# Altium schematic sheet 01_MCU.SchDoc: MCU
size A4; Project_Name: Monitoring_Control_Circuit; Designer: Hao Thai; Version: 1.0
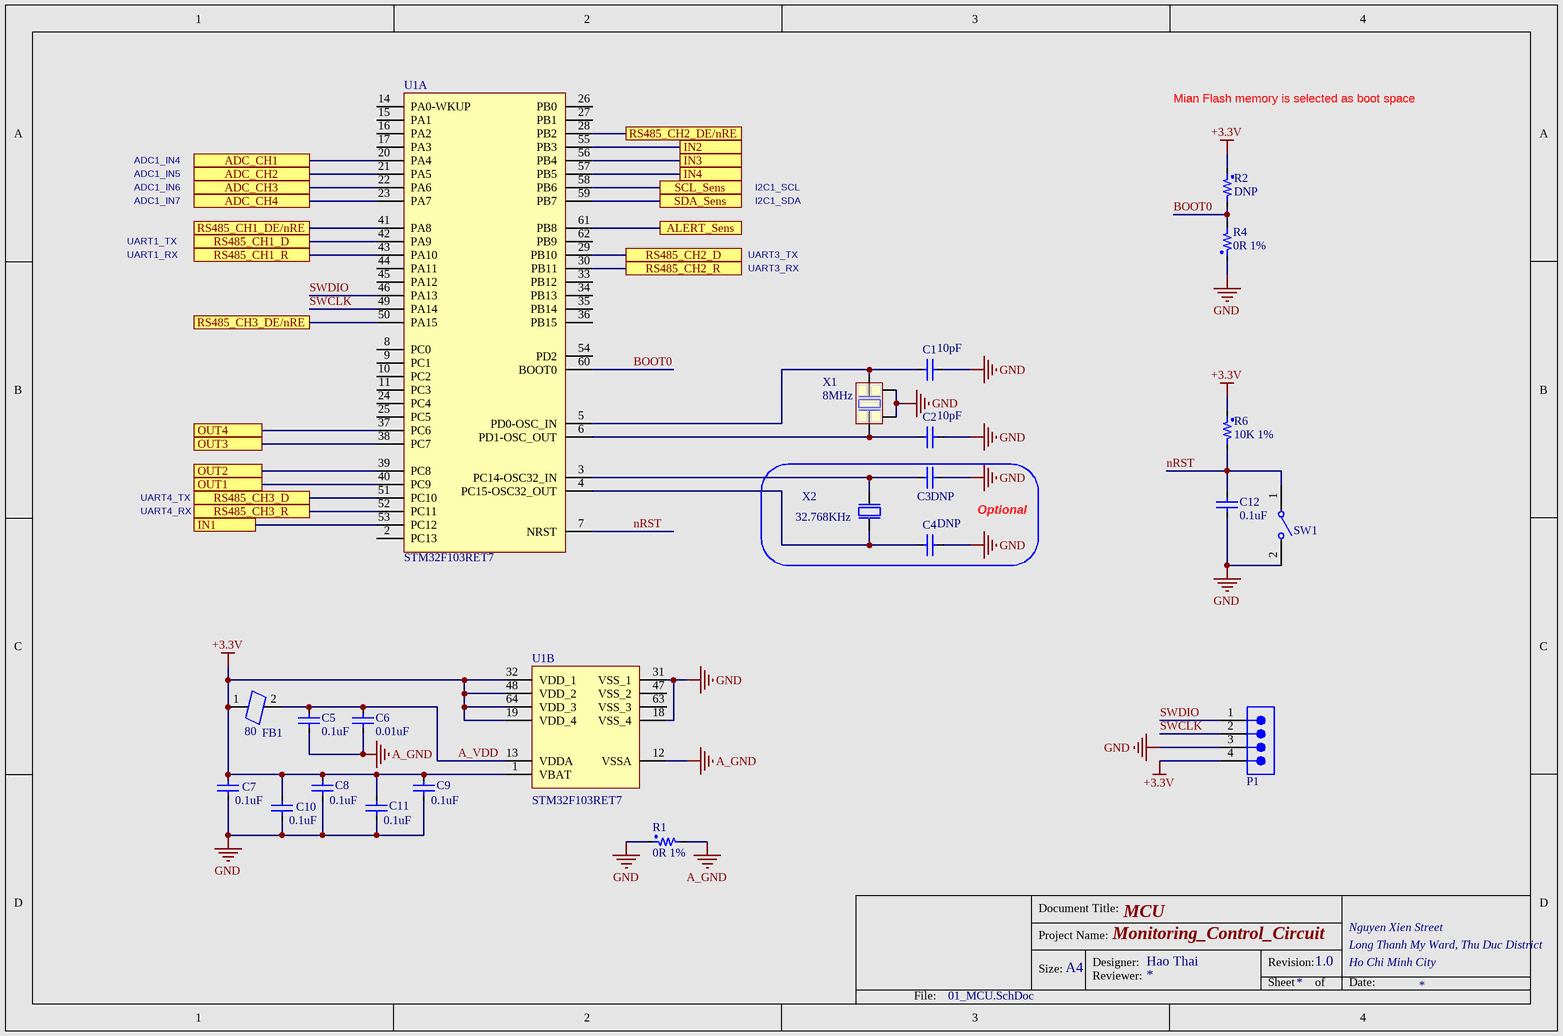
[diagram p0: 01_MCU.SchDoc]

## Parts
C1  10pF  [C0603 (1608 metric)]
C2  10pF  [C0603 (1608 metric)]
C3  DNP  [C0603 (1608 metric)]  (no BOM)
C4  DNP  [C0603 (1608 metric)]  (no BOM)
C5  0.1uF  [C0603 (1608 metric)]
C6  0.01uF  [C0603 (1608 metric)]
C7  0.1uF  [C0603 (1608 metric)]
C8  0.1uF  [C0603 (1608 metric)]
C9  0.1uF  [C0603 (1608 metric)]
C10  0.1uF  [C0603 (1608 metric)]
C11  0.1uF  [C0603 (1608 metric)]
C12  0.1uF  [C0603 (1608 metric)]
FB1  80  [FB0805 (2012 METRIC)]
P1  61300411121  [61300411121]  (value not drawn)
R1  0R 1%  [R0603 (1608 Metric)]
R2  DNP  [R0603 (1608 Metric)]  (no BOM)
R4  0R 1%  [R0603 (1608 Metric)]
R6  10K 1%  [R0603 (1608 Metric)]
SW1  434121025816  [WS-TASV_L6W3.8H2.5_4341x10258x6]  (value not drawn)
U1  STM32F103RET7  [STM-LQFP64_N]  (parts A,B of 2)
X1  8MHz  [TSX_3225]
X2  32.768KHz  [XTAL_3215_2Pin]  (no BOM)

## Blocks framed on the sheet
Optional: C3 C4 X2

## Ports
ADC_CH1, ADC_CH2, ADC_CH3, ADC_CH4, ALERT_Sens, IN1, IN2, IN3, IN4, OUT1, OUT2, OUT3, OUT4, RS485_CH1_D, RS485_CH1_DE/nRE, RS485_CH1_R, RS485_CH2_D, RS485_CH2_DE/nRE, RS485_CH2_R, RS485_CH3_D, RS485_CH3_DE/nRE, RS485_CH3_R, SCL_Sens, SDA_Sens

## Nets
+3.3V: C7.2 C8.2 C9.2 C10.2 C11.2 FB1.1 P1.4 R2.1 R6.1 U1.1(VBAT) U1.19(VDD_4) U1.32(VDD_1) U1.48(VDD_2) U1.64(VDD_3)
A_GND: C5.1 C6.1 R1.2 U1.12(VSSA)
GND: C1.1 C2.1 C3.2 C4.2 C7.1 C8.1 C9.1 C10.1 C11.1 C12.2 P1.3 R1.1 R4.1 SW1.2 U1.18(VSS_4) U1.31(VSS_1) X1.2(GND) X1.4(GND)
A_VDD: C5.2 C6.2 FB1.2 U1.13(VDDA)
ADC_CH1: U1.20(PA4) ; port ADC_CH1
ADC_CH2: U1.21(PA5) ; port ADC_CH2
ADC_CH3: U1.22(PA6) ; port ADC_CH3
ADC_CH4: U1.23(PA7) ; port ADC_CH4
ALERT_Sens: U1.61(PB8) ; port ALERT_Sens
BOOT0: R2.2 R4.2 U1.60(BOOT0)
IN1: U1.53(PC12) ; port IN1
IN2: U1.55(PB3) ; port IN2
IN3: U1.56(PB4) ; port IN3
IN4: U1.57(PB5) ; port IN4
nRST: C12.1 R6.2 SW1.1 U1.7(NRST)
OUT1: U1.40(PC9) ; port OUT1
OUT2: U1.39(PC8) ; port OUT2
OUT3: U1.38(PC7) ; port OUT3
OUT4: U1.37(PC6) ; port OUT4
RS485_CH1_D: U1.42(PA9) ; port RS485_CH1_D
RS485_CH1_DE/nRE: U1.41(PA8) ; port RS485_CH1_DE/nRE
RS485_CH1_R: U1.43(PA10) ; port RS485_CH1_R
RS485_CH2_D: U1.29(PB10) ; port RS485_CH2_D
RS485_CH2_DE/nRE: U1.28(PB2) ; port RS485_CH2_DE/nRE
RS485_CH2_R: U1.30(PB11) ; port RS485_CH2_R
RS485_CH3_D: U1.51(PC10) ; port RS485_CH3_D
RS485_CH3_DE/nRE: U1.50(PA15) ; port RS485_CH3_DE/nRE
RS485_CH3_R: U1.52(PC11) ; port RS485_CH3_R
SCL_Sens: U1.58(PB6) ; port SCL_Sens
SDA_Sens: U1.59(PB7) ; port SDA_Sens
SWCLK: P1.2 U1.49(PA14)
SWDIO: P1.1 U1.46(PA13)
NetC1_2: C1.2 U1.5(PD0-OSC_IN) X1.1(Input)
NetC2_2: C2.2 U1.6(PD1-OSC_OUT) X1.3(Out)
NetC3_1: C3.1 U1.3(PC14-OSC32_IN) X2.2(out)
NetC4_1: C4.1 U1.4(PC15-OSC32_OUT) X2.1(inp)

Not connected (* = marked no-connect by the designer): U1 2(PC13) 8(PC0) 9(PC1) 10(PC2) 11(PC3) 14(PA0-WKUP) 15(PA1) 16(PA2) 17(PA3) 24(PC4) 25(PC5) 26(PB0) 27(PB1) 33(PB12) 34(PB13) 35(PB14) 36(PB15) 44(PA11) 45(PA12) 47(VSS_2) 54(PD2) 62(PB9) 63(VSS_3)

## Notes on the sheet
- Mian Flash memory is selected as boot space
- ADC1_IN4
- ADC1_IN5
- UART1_TX
- ADC1_IN6
- ADC1_IN7
- I2C1_SCL
- I2C1_SDA
- UART1_RX
- UART3_TX
- UART3_RX
- UART4_TX
- UART4_RX
- Document Title:
- Size:
- Project Name:
- A4
- Designer:
- Reviewer:
- Revision:
- Sheet
- of
- Nguyen Xien Street
- Long Thanh My Ward, Thu Duc District
- Ho Chi Minh City
- Date:
- File:

## Library data of the parts
C1 C2 = CC0603JRNPO9BN100: Multilayer Ceramic Capacitors MLCC - SMD/SMT 10pF 250V C0G +/-5% 0603; Mfr: Yageo; Dielectric: C0G (NP0); Voltage: 50V; Tolerance: 5%; Mfr Part Number: CC0603JRNPO9BN100; Supplier Part Number 1: 603-CC603JRNPO9BN100; Supplier 1: Mouser; Value: 10pF; Case: 0603 (1608 metric)
C3 C4 = CC0603JRNPO9BN120: Multilayer Ceramic Capacitors MLCC - SMD/SMT 12pF 250V C0G +/-5% 0603; Mfr: Yageo; Dielectric: C0G (NP0); Voltage: 50V; Tolerance: 5%; Mfr Part Number: CC0603JRNPO9BN120; Supplier Part Number 1: 603-CC603JRNPO9BN120; Supplier 1: Mouser; Value: 12pF; Case: 0603 (1608 metric)
C5 C7-C12 = CC0603KRX7R9BB104: Multilayer Ceramic Capacitors MLCC - SMD/SMT 0.1uF 50V X7R +/-10% 0603; Mfr: Yageo; Tolerance: 10%; Mfr Part Number: CC0603KRX7R9BB104; Supplier Part Number 1: 603-CC603KRX7R9BB104; Supplier 1: Mouser; Value: 0.1uF; Dielectric: X7R; Case: 0603 (1608 metric); Voltage: 50V
C6 = CC0603KRX7R9BB103: Multilayer Ceramic Capacitors MLCC - SMD/SMT 0.01uF 50V X7R +/-10% 0603; Mfr: Yageo; Tolerance: 10%; Mfr Part Number: CC0603KRX7R9BB103; Supplier Part Number 1: 603-CC603KRX7R9BB103; Supplier 1: Mouser; Value: 0.01uF; Dielectric: X7R; Case: 0603 (1608 metric); Voltage: 50V
FB1 = FBMH2012HM800-T: Ferrite Beads HI CUR CHIP BD 0805 80OHMS 25%; Mfr: Taiyo Yuden; Maximum DC Resistance: 25 mOhm; Maximum DC Current: 2.7A; Impedance: 80; Supplier Part Number 1: 963-FBMH2012HM800-T; Mfr Part Number: FBMH2012HM800-T; Supplier 1: Mouser; Tolerance: 25%; Package: 0805 (2012 metric)
P1 = 61300411121: WR-PHD Pin Header, THT, Vertical, pitch 2.54mm, 1 Row, 4P; Mfr: Wurth Elektronik; Contact Resistance: 20mΩ; Rated Current: 3A; Working Voltage: 250V; Withstanding Voltage: 500V; ComponentLink1Description: Website Link; ComponentLink1URL: https://www.we-online.com/redexpert/article/61300411121?ad; ComponentLink2Description: Datasheet Link; ComponentLink2URL: https://www.we-online.com/redexpert/spec/61300411121?ad; Mfr Part Number: 61300411121; Category: Board-to-Board Connectors; Match Code: WR-PHD; Mount: Through Hole; Operating Temperature Max: 105°C; Operating Temperature Min: -40°C; Packaging: Bag; Gender: Pin Header; Number of Pins: 4; Number of Rows: 1; Orientation: Vertical; Pitch: 2.54mm
R1 R4 = RC0603FR-070RL: Thick Film Resistors - SMD 0 OHM 1% Case 0603; Mfr: Yageo; Value: 0R; Supplier 1: Mouser; Supplier Part Number 1: 603-RC0603FR-070RL; Mfr Part Number: RC0603FR-070RL; Case: 0603 (1608 metric); Tolerance: 1%
R2 R6 = RC0603FR-0710KL: Thick Film Resistors - SMD 10K OHM 1% Case 0603; Mfr: Yageo; Value: 10K; Supplier 1: Mouser; Supplier Part Number 1: 603-RC0603FR-0710KL; Mfr Part Number: RC0603FR-0710KL; Case: 0603 (1608 metric); Tolerance: 1%
SW1 = 434121025816: WS-TASV SMT Tact Switch, SPST-NO, 12VDC, 50mA, 160g; Mfr: Wurth Elektronik; Washable: No; ComponentLink1Description: Website Link; ComponentLink1URL: https://www.we-online.com/redexpert/article/434121025816?ad; ComponentLink2Description: Datasheet Link; ComponentLink2URL: https://www.we-online.com/redexpert/spec/434121025816?ad; Mfr Part Number: 434121025816; Category: Tact Switches; Match Code: WS-TASV; Mount: Surface Mount; Operating Temperature Max: 85°C; Operating Temperature Min: -40°C; Packaging: Tape and Reel; Length: 6mm; Width: 3.8mm; Height: 2.5mm; Circuit: SPST-NO; Contact Material: Stainless Steel; Contact Plating: Silver; Operation Force: 160g; Rated Current: 50mA; Rated Voltage: 12VDC; Terminal Material: Copper Alloy; Terminal Plating: Silver
U1 = STM32F103RET7: ARM Cortex-M3 32-bit MCU, 512 KB Flash, 64 KB Internal RAM, 51 I/Os, 64-pin LQFP, -40 to 105 degC, Tray; Mfr: STMicroelectronics; DatasheetVersion: Rev. 8; PackageVersion: Rev. 4, 06/2013; PackageReference: LQFP64; PackageDescription: 64-Pin Low Profile Quad Flat Package, 10 x 10 mm Body, 0.5 mm Pitch; Supplier 1: Mouser; Supplier Part Number 1: 511-STM32F103RET7; ComponentLink1Description: Manufacturer URL; ComponentLink1URL: http://www.st.com/web/en/home.html; ComponentLink2Description: Datasheet; ComponentLink2URL: http://www.st.com/st-web-ui/static/active/en/resource/technical/document/datasheet/CD00191185.pdf; ComponentLink3Description: Package Specification; ComponentLink3URL: http://www.st.com/st-web-ui/static/active/en/resource/technical/document/datasheet/DM00037051.pdf; Mfr Part Number: STM32F103RET7
X1 = ECS-80-10-33-CHN-TR: Crystals CRYSTAL 8.0000MHZ 10PF SMD,ECX-32,+/-10ppm,+/-25ppm,400 Ohm,Fundamental,-40 C 85 C,4-SMD, No Lead; Mfr: ECS; Tolerance: 10 PPM; Frequency Stability: 20ppm; Value: 8MHz; Mfr Part Number: ECS-80-10-33-CHN-TR; Supplier 1: Mouser; Load Capacitance: 10 pF; Supplier Part Number 1: 520-ECS-80-1033CHNTR; Package: 3.2 mm x 2.5 mm
X2 = ECS-.327-12.5-34B-TR: Crystals 32.768KHz 20ppm 12.5pF -40C +85C; Mfr: ECS; Mfr Part Number: ECS-.327-12.5-34B-TR; Pin Count: 2; Value: 32.768KHz; Package: 3.2 mm x 1.5 mm; Supplier 1: Mouser; Supplier Part Number 1: 520-327-12.5-34B; Tolerance: 20 ppm